# Altium schematic sheet STM32F1_CNC_SCHC.SchDoc
size A4
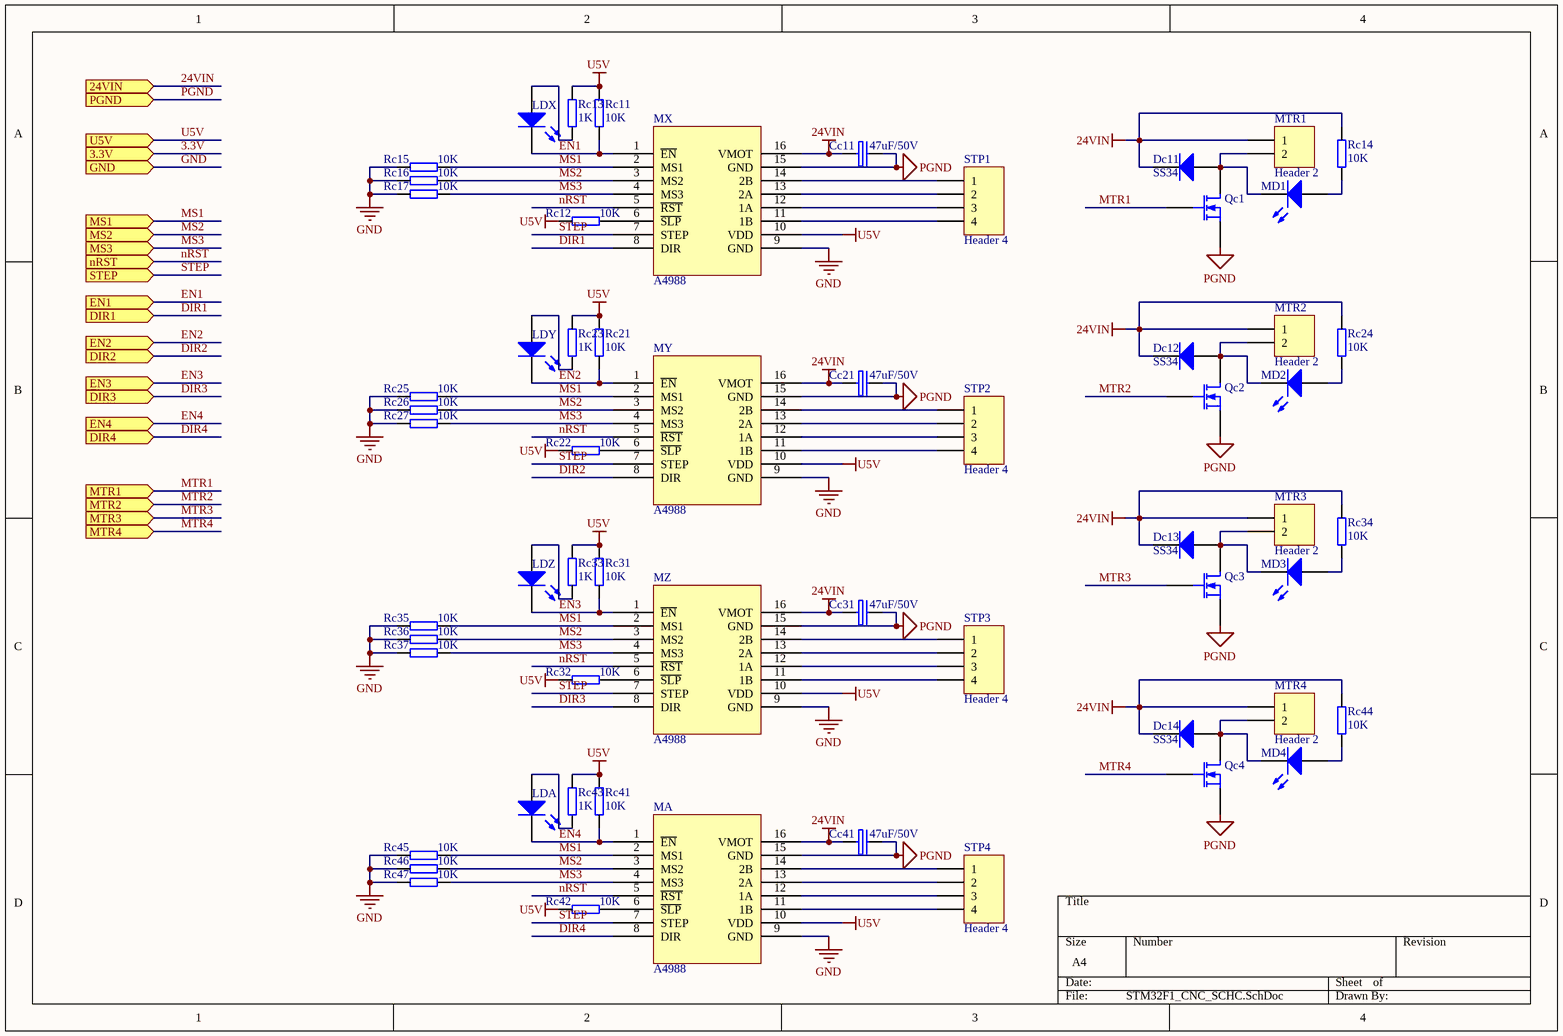
[diagram p0: STM32F1_CNC_SCHC.SchDoc]

## Parts
Cc11  47uF/50V  [SMD-EC-F6.3]
Cc21  47uF/50V  [SMD-EC-F6.3]
Cc31  47uF/50V  [SMD-EC-F6.3]
Cc41  47uF/50V  [SMD-EC-F6.3]
Dc11  SS34  [SMA]
Dc12  SS34  [SMA]
Dc13  SS34  [SMA]
Dc14  SS34  [SMA]
LDA  LED  [LED-0805]  (value not drawn)
LDX  LED  [LED-0805]  (value not drawn)
LDY  LED  [LED-0805]  (value not drawn)
LDZ  LED  [LED-0805]  (value not drawn)
MA  A4988  [A4988]
MD1  LED  [LED-0805]  (value not drawn)
MD2  LED  [LED-0805]  (value not drawn)
MD3  LED  [LED-0805]  (value not drawn)
MD4  LED  [LED-0805]  (value not drawn)
MTR1  Header 2  [DG1282-5.0]
MTR2  Header 2  [DG1282-5.0]
MTR3  Header 2  [DG1282-5.0]
MTR4  Header 2  [DG1282-5.0]
MX  A4988  [A4988]
MY  A4988  [A4988]
MZ  A4988  [A4988]
Qc1  MOSFET-N  [LR7843]  (value not drawn)
Qc2  MOSFET-N  [LR7843]  (value not drawn)
Qc3  MOSFET-N  [LR7843]  (value not drawn)
Qc4  MOSFET-N  [LR7843]  (value not drawn)
Rc11  10K  [0603]
Rc12  10K  [0603]
Rc13  1K  [0603]
Rc14  10K  [0603]
Rc15  10K  [0603]
Rc16  10K  [0603]
Rc17  10K  [0603]
Rc21  10K  [0603]
Rc22  10K  [0603]
Rc23  1K  [0603]
Rc24  10K  [0603]
Rc25  10K  [0603]
Rc26  10K  [0603]
Rc27  10K  [0603]
Rc31  10K  [0603]
Rc32  10K  [0603]
Rc33  1K  [0603]
Rc34  10K  [0603]
Rc35  10K  [0603]
Rc36  10K  [0603]
Rc37  10K  [0603]
Rc41  10K  [0603]
Rc42  10K  [0603]
Rc43  1K  [0603]
Rc44  10K  [0603]
Rc45  10K  [0603]
Rc46  10K  [0603]
Rc47  10K  [0603]
STP1  Header 4  [HDR-2.54-4P]
STP2  Header 4  [HDR-2.54-4P]
STP3  Header 4  [HDR-2.54-4P]
STP4  Header 4  [HDR-2.54-4P]

## Ports
3.3V (in), 24VIN (in), DIR1 (in), DIR2 (in), DIR3 (in), DIR4 (in), EN1 (in), EN2 (in), EN3 (in), EN4 (in), GND (in), MS1 (in), MS2 (in), MS3 (in), MTR1 (in), MTR2 (in), MTR3 (in), MTR4 (in), nRST (in), PGND (in), STEP (in), U5V (in)

## Nets
24VIN: Cc11.1 Cc21.1 Cc31.1 Cc41.1 Dc11.2(K) Dc12.2(K) Dc13.2(K) Dc14.2(K) MA.16(VMOT) MTR1.1 MTR2.1 MTR3.1 MTR4.1 MX.16(VMOT) MY.16(VMOT) MZ.16(VMOT) Rc14.1 Rc24.1 Rc34.1 Rc44.1 ; port 24VIN
GND: MA.9(GND) MX.9(GND) MY.9(GND) MZ.9(GND) Rc15.1 Rc16.1 Rc17.1 Rc25.1 Rc26.1 Rc27.1 Rc35.1 Rc36.1 Rc37.1 Rc45.1 Rc46.1 Rc47.1 ; port GND
PGND: Cc11.2 Cc21.2 Cc31.2 Cc41.2 MA.15(GND) MX.15(GND) MY.15(GND) MZ.15(GND) Qc1.3(S) Qc2.3(S) Qc3.3(S) Qc4.3(S) ; port PGND
U5V: MA.10(VDD) MX.10(VDD) MY.10(VDD) MZ.10(VDD) Rc11.2 Rc12.1 Rc13.1 Rc21.2 Rc22.1 Rc23.1 Rc31.2 Rc32.1 Rc33.2 Rc41.2 Rc42.1 Rc43.1 ; port U5V
3.3V: port 3.3V
DIR1: MX.8(DIR) ; port DIR1
DIR2: MY.8(DIR) ; port DIR2
DIR3: MZ.8(DIR) ; port DIR3
DIR4: MA.8(DIR) ; port DIR4
EN1: LDX.2(K) MX.1(~{EN}) Rc11.1 ; port EN1
EN2: LDY.2(K) MY.1(~{EN}) Rc21.1 ; port EN2
EN3: LDZ.2(K) MZ.1(~{EN}) Rc31.1 ; port EN3
EN4: LDA.2(K) MA.1(~{EN}) Rc41.1 ; port EN4
MS1: MA.2(MS1) MX.2(MS1) MY.2(MS1) MZ.2(MS1) Rc15.2 Rc25.2 Rc35.2 Rc45.2 ; port MS1
MS2: MA.3(MS2) MX.3(MS2) MY.3(MS2) MZ.3(MS2) Rc16.2 Rc26.2 Rc36.2 Rc46.2 ; port MS2
MS3: MA.4(MS3) MX.4(MS3) MY.4(MS3) MZ.4(MS3) Rc17.2 Rc27.2 Rc37.2 Rc47.2 ; port MS3
MTR1: Qc1.1(G) ; port MTR1
MTR2: Qc2.1(G) ; port MTR2
MTR3: Qc3.1(G) ; port MTR3
MTR4: Qc4.1(G) ; port MTR4
nRST: MA.5(~{RST}) MX.5(~{RST}) MY.5(~{RST}) MZ.5(~{RST}) ; port nRST
STEP: MA.7(STEP) MX.7(STEP) MY.7(STEP) MZ.7(STEP) ; port STEP
NetDc11_1: Dc11.1(A) MD1.2(K) MTR1.2 Qc1.2(D)
NetDc12_1: Dc12.1(A) MD2.2(K) MTR2.2 Qc2.2(D)
NetDc13_1: Dc13.1(A) MD3.2(K) MTR3.2 Qc3.2(D)
NetDc14_1: Dc14.1(A) MD4.2(K) MTR4.2 Qc4.2(D)
NetLDA_1: LDA.1(A) Rc43.2
NetLDX_1: LDX.1(A) Rc13.2
NetLDY_1: LDY.1(A) Rc23.2
NetLDZ_1: LDZ.1(A) Rc33.1
NetMA_6: MA.6(~{SLP}) Rc42.2
NetMA_11: MA.11(1B) STP4.4
NetMA_12: MA.12(1A) STP4.3
NetMA_13: MA.13(2A) STP4.2
NetMA_14: MA.14(2B) STP4.1
NetMD1_1: MD1.1(A) Rc14.2
NetMD2_1: MD2.1(A) Rc24.2
NetMD3_1: MD3.1(A) Rc34.2
NetMD4_1: MD4.1(A) Rc44.2
NetMX_6: MX.6(~{SLP}) Rc12.2
NetMX_11: MX.11(1B) STP1.4
NetMX_12: MX.12(1A) STP1.3
NetMX_13: MX.13(2A) STP1.2
NetMX_14: MX.14(2B) STP1.1
NetMY_6: MY.6(~{SLP}) Rc22.2
NetMY_11: MY.11(1B) STP2.4
NetMY_12: MY.12(1A) STP2.3
NetMY_13: MY.13(2A) STP2.2
NetMY_14: MY.14(2B) STP2.1
NetMZ_6: MZ.6(~{SLP}) Rc32.2
NetMZ_11: MZ.11(1B) STP3.4
NetMZ_12: MZ.12(1A) STP3.3
NetMZ_13: MZ.13(2A) STP3.2
NetMZ_14: MZ.14(2B) STP3.1

## Library data of the parts
Cc11 Cc21 Cc31 Cc41 = EC1: Electro Capacitor
Dc11-Dc14 = Diode BAT18: Low-Loss RF Switching Diode; Note: Pin 2 is not connected and not drawn.; Published: 21-Mar-2003; LatestRevisionDate: 29-May-2009; LatestRevisionNote: IPC-7351 Footprint Added.; DatasheetVersion: Oct-1999; PackageVersion: Sep-2001; PackageReference: SOT-23; Publisher: Altium Limited; PackageDescription: 3-Pin SOT-23 Package 0.95 mm Pitch, 2.5 mm Lead Span; ComponentLink1Description: Manufacturer Link; ComponentLink1URL: http://www.infineon.com/
LDA LDX LDY LDZ MD1-MD4 = LED2: Typical RED, GREEN, YELLOW, AMBER GaAs LED; Published: 8-Jun-2000; LatestRevisionDate: 17-Jul-2002; LatestRevisionNote: Re-released for DXP Platform.; PackageVersion: Feb-2002; PackageReference: 3.2X1.6X1.1; Publisher: Altium Limited; PackageDescription: SM LED; 2 Flat Leads
MTR1-MTR4 = Header 2: Header, 2-Pin; LatestRevisionDate: 17-Jul-2002; LatestRevisionNote: Re-released for DXP Platform.; Publisher: Altium Limited
Qc1-Qc4 = MOSFET-N: N-Channel MOSFET; Published: 8-Jun-2000; LatestRevisionDate: 17-Jul-2002; LatestRevisionNote: Re-released for DXP Platform.; PackageVersion: 1995/1996; PackageReference: E3; Publisher: Altium Limited; PackageDescription: TO, Flat Index; 3 In-Line, Axial Leads; Body Dia. 4.6mm; Lead Dia. 0.5 mm (max)
Rc11-Rc17 Rc21-Rc27 Rc31-Rc37 Rc41-Rc47 = RES1: Resister
  Rc11 Rc12 Rc15-Rc17 Rc21 Rc22 Rc25-Rc27 Rc31 Rc32 Rc35-Rc37 Rc41 Rc42 Rc45-Rc47: value: 10K
STP1-STP4 = Header 4: Header, 4-Pin; LatestRevisionDate: 17-Jul-2002; LatestRevisionNote: Re-released for DXP Platform.; Publisher: Altium Limited